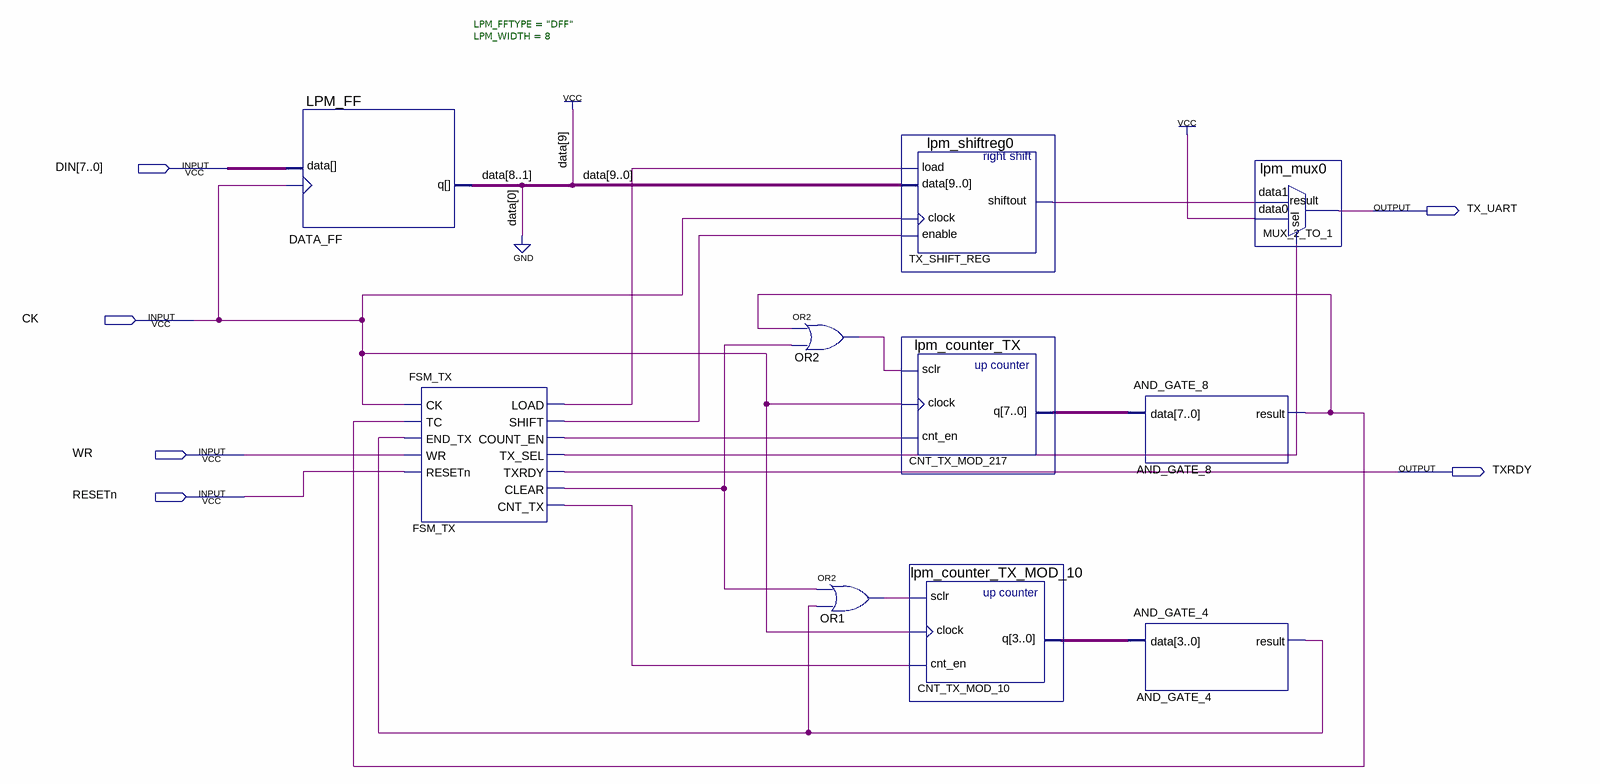
[diagram p0: schematic sheet]
// Quartus schematic TX.bdf as structural Verilog: 10 symbols, 6 pins
module TX (
  input  [7:0] DIN,
  input  CK,
  input  WR,
  input  RESETn,
  output TX_UART,
  output TXRDY
);

  wire AND_GATE_4_result, AND_GATE_8_result, FSM_TX_clear, FSM_TX_cnt_tx, FSM_TX_count_en, FSM_TX_load,
       FSM_TX_shift, FSM_TX_tx_sel, OR1_out, OR2_out, TX_SHIFT_REG_shiftout;
  wire [3:0] CNT_TX_MOD_10_q;
  wire [7:0] CNT_TX_MOD_217_q;
  wire [8:1] data;

  LPM_FF #(.LPM_FFTYPE("DFF"), .LPM_WIDTH(8)) DATA_FF (.clock(CK), .data(DIN), .q(data));
  FSM_TX FSM_TX (
    .CK(CK), .TC(AND_GATE_8_result), .END_TX(AND_GATE_4_result), .WR(WR), .RESETn(RESETn),
    .LOAD(FSM_TX_load), .SHIFT(FSM_TX_shift), .COUNT_EN(FSM_TX_count_en), .TX_SEL(FSM_TX_tx_sel),
    .TXRDY(TXRDY), .CLEAR(FSM_TX_clear), .CNT_TX(FSM_TX_cnt_tx));
  or OR2 (OR2_out, AND_GATE_8_result, FSM_TX_clear);
  or OR1 (OR1_out, FSM_TX_clear, AND_GATE_4_result);
  lpm_shiftreg0 TX_SHIFT_REG (
    .load(FSM_TX_load), .data({1'b1, data, 1'b0}), .clock(CK), .enable(FSM_TX_shift),
    .shiftout(TX_SHIFT_REG_shiftout));
  lpm_counter_TX CNT_TX_MOD_217 (.sclr(OR2_out), .clock(CK), .cnt_en(FSM_TX_count_en), .q(CNT_TX_MOD_217_q));
  lpm_counter_TX_MOD_10 CNT_TX_MOD_10 (.sclr(OR1_out), .clock(CK), .cnt_en(FSM_TX_cnt_tx), .q(CNT_TX_MOD_10_q));
  AND_GATE_8 AND_GATE_8 (.data(CNT_TX_MOD_217_q), .result(AND_GATE_8_result));
  AND_GATE_4 AND_GATE_4 (.data(CNT_TX_MOD_10_q), .result(AND_GATE_4_result));
  lpm_mux0 MUX_2_TO_1 (.data1(TX_SHIFT_REG_shiftout), .data0(1'b1), .sel(FSM_TX_tx_sel), .result(TX_UART));
endmodule
